# Altium schematic sheet SCH_7805.SchDoc
size A
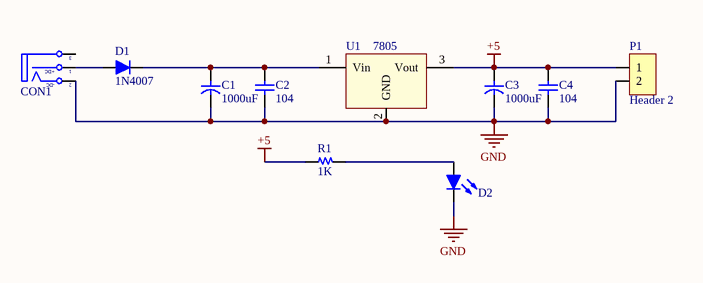
[diagram p0: SCH_7805.SchDoc]

## Parts
C1  1000uF  [CYL/D.400/LS.200]
C2  104  [CAP Ceramic/W300]
C3  1000uF  [CYL/D.400/LS.200]
C4  104  [CAP Ceramic/W300]
CON1  CON DC PWR  [CONN/DC/PWR/5.0MM]  (value not drawn)
D1  1N4007  [DO-35 (SOD27 )]
D2  Led  [LED 5MM - RED]  (value not drawn)
P1  Header 2  [HDR/Terminal/2]
R1  1K  [R 1/4W/300]
U1  7805  [TO-220]

## Nets
+5: C3.1 C4.1 P1.1 R1.1 U1.3(Vout)
GND: C1.2 C2.2 C3.2 C4.2 CON1.2(T) D2.2(K) P1.2 U1.2(GND)
NetC1_1: C1.1 C2.1 D1.2(K) U1.1(Vin)
NetCON1_1: CON1.1(S) D1.1(A)
NetD2_1: D2.1(A) R1.2

Not connected (* = marked no-connect by the designer): CON1 3(TN)

## Notes on the sheet
- (in symbol CON DC PWR) +DC; -DC

## Library data of the parts
C1 C3 = Capacitor: Capacitor pol
C2 C4 = Capacitor NP: Capacitor non-pol
CON1 = CON DC PWR: DC input connector
D1 = Diode: Default Diode
D2 = Led: Typical LED
P1 = Header 2: Header, 2-Pin
R1 = Resistor
U1 = 78xx: LDO Fixed Voltage regulator